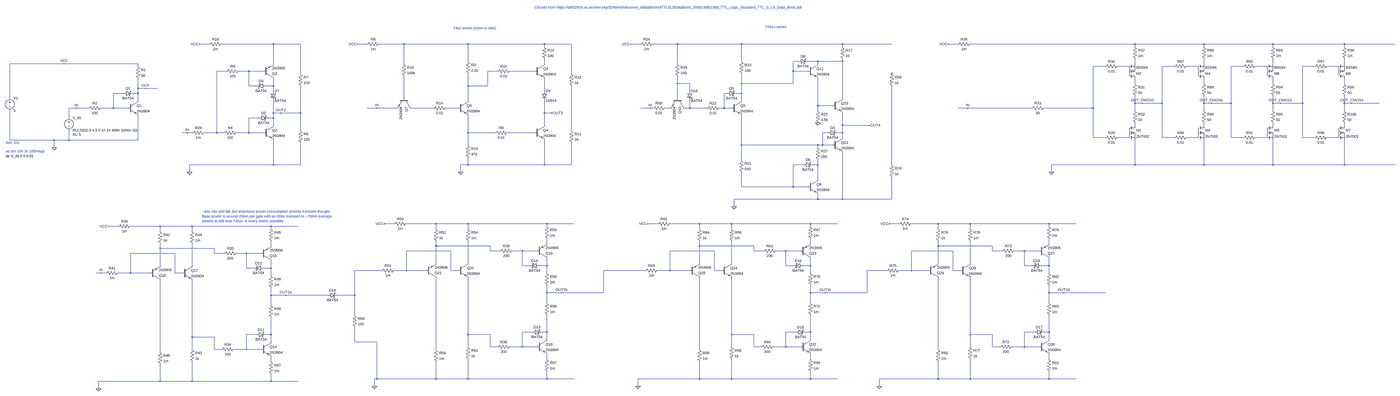
[diagram p0: schematic ttl_inverters.asc, whole sheet]
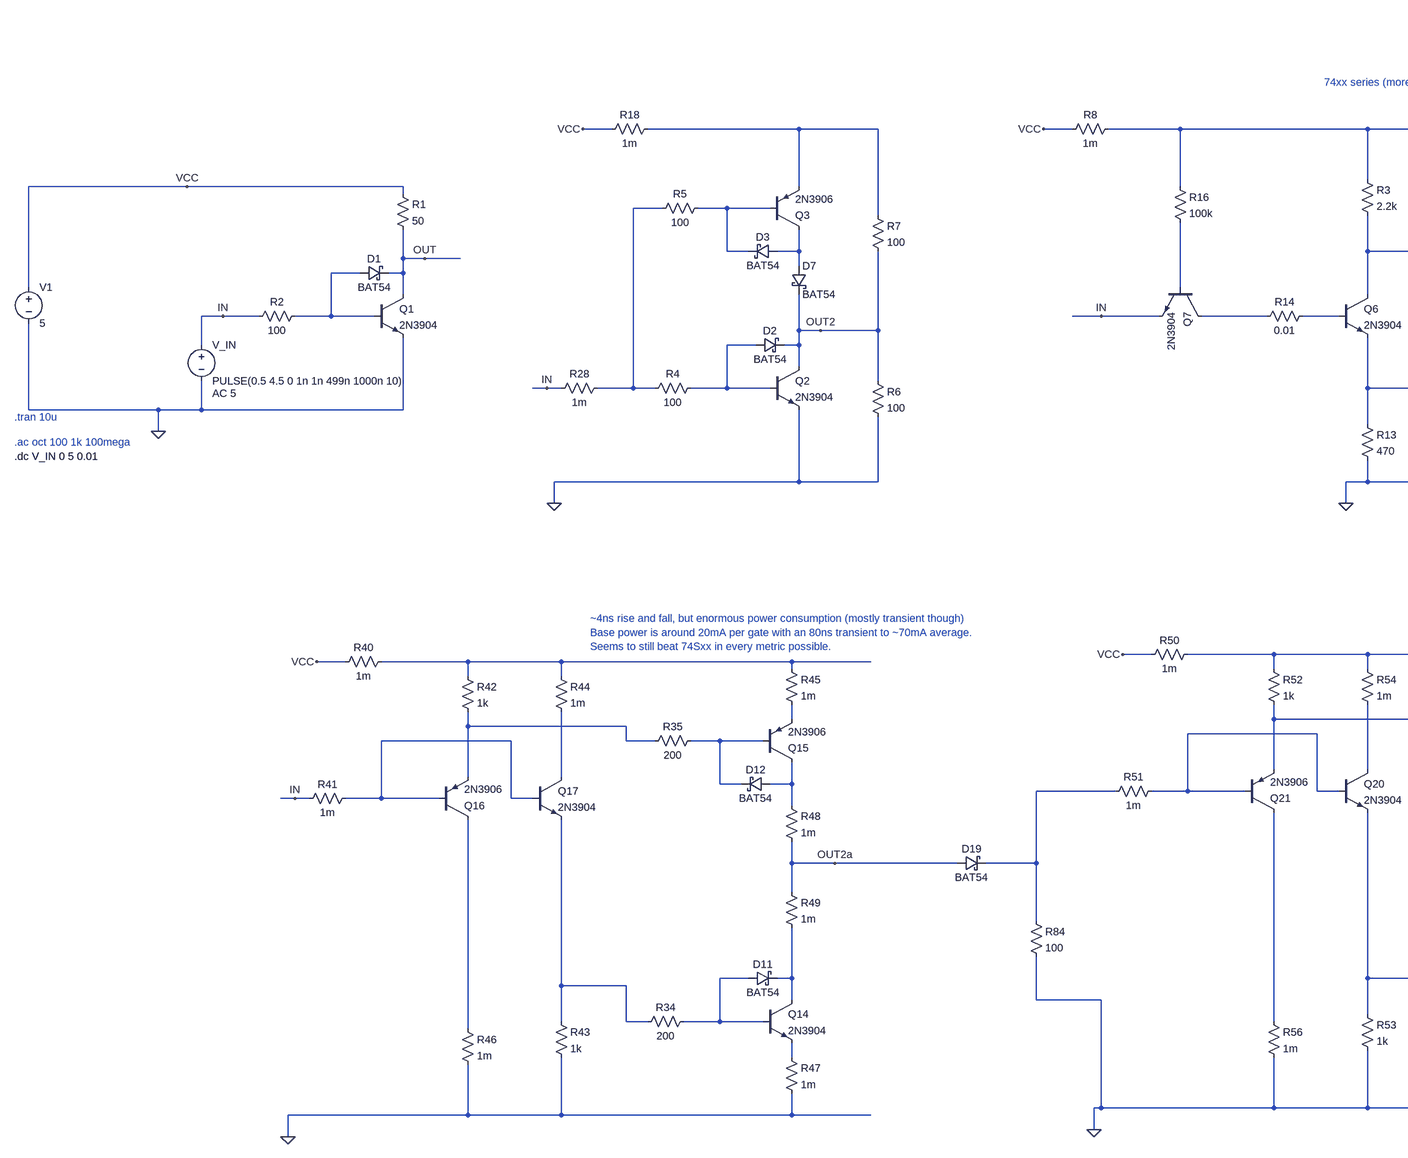
[diagram p1: schematic ttl_inverters.asc, part, row 1 of 1, column 1 of 3]
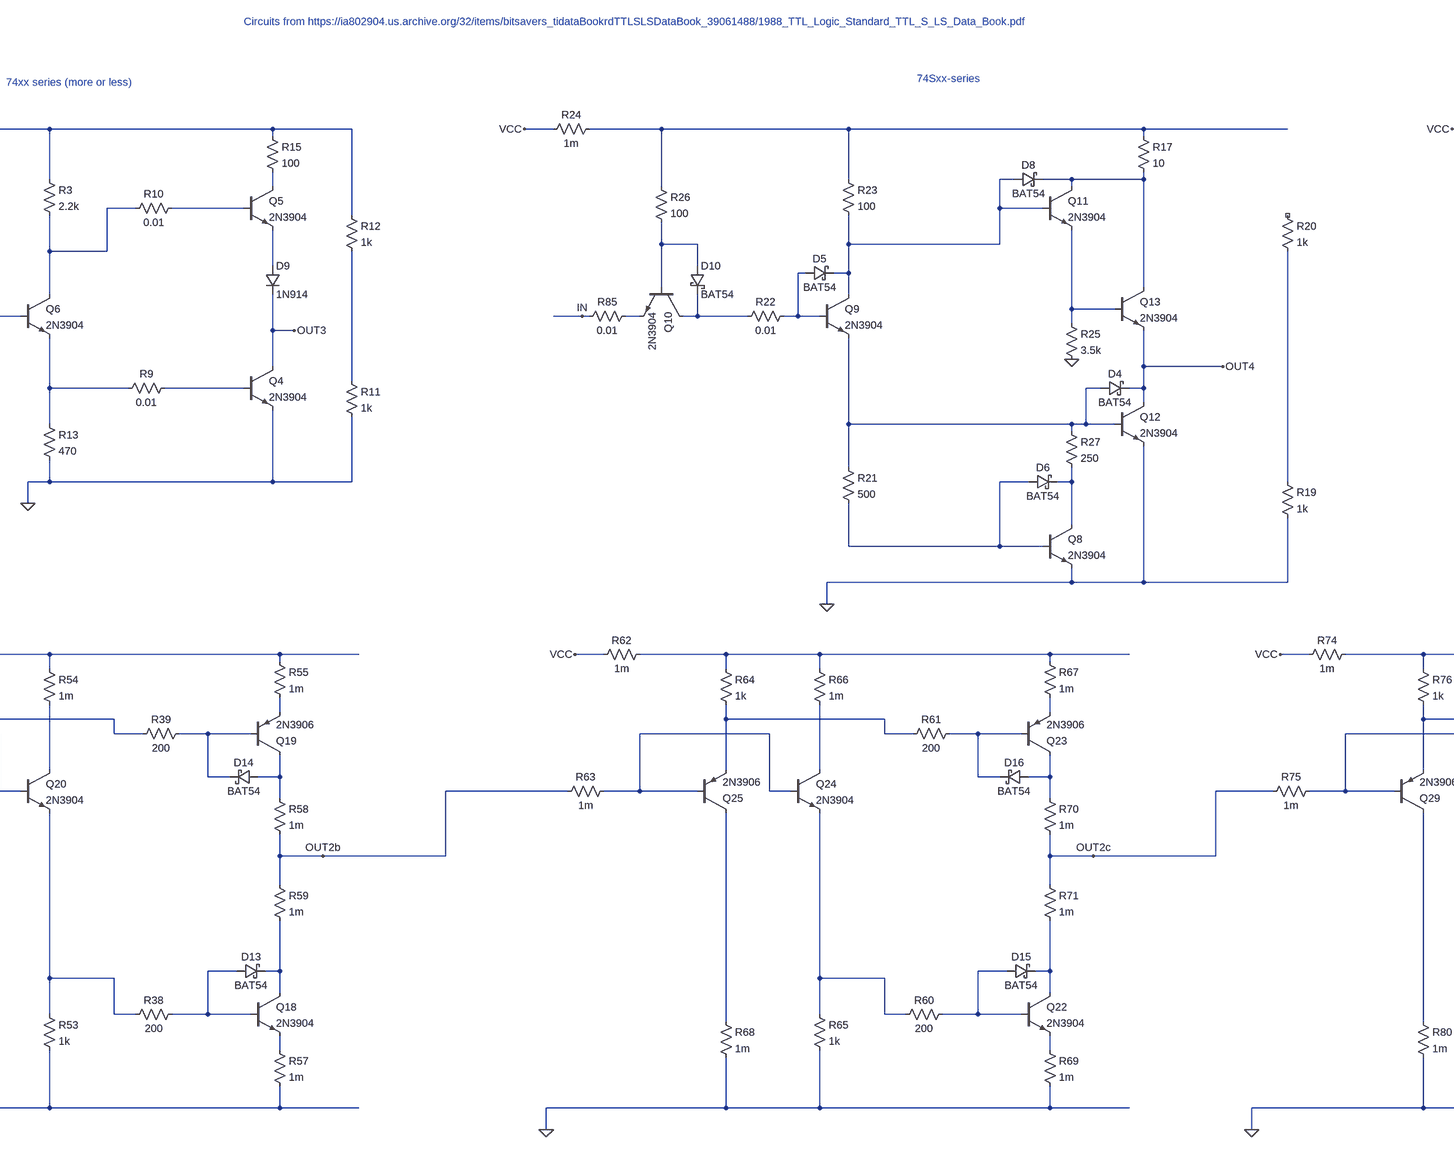
[diagram p2: schematic ttl_inverters.asc, part, row 1 of 1, column 2 of 3]
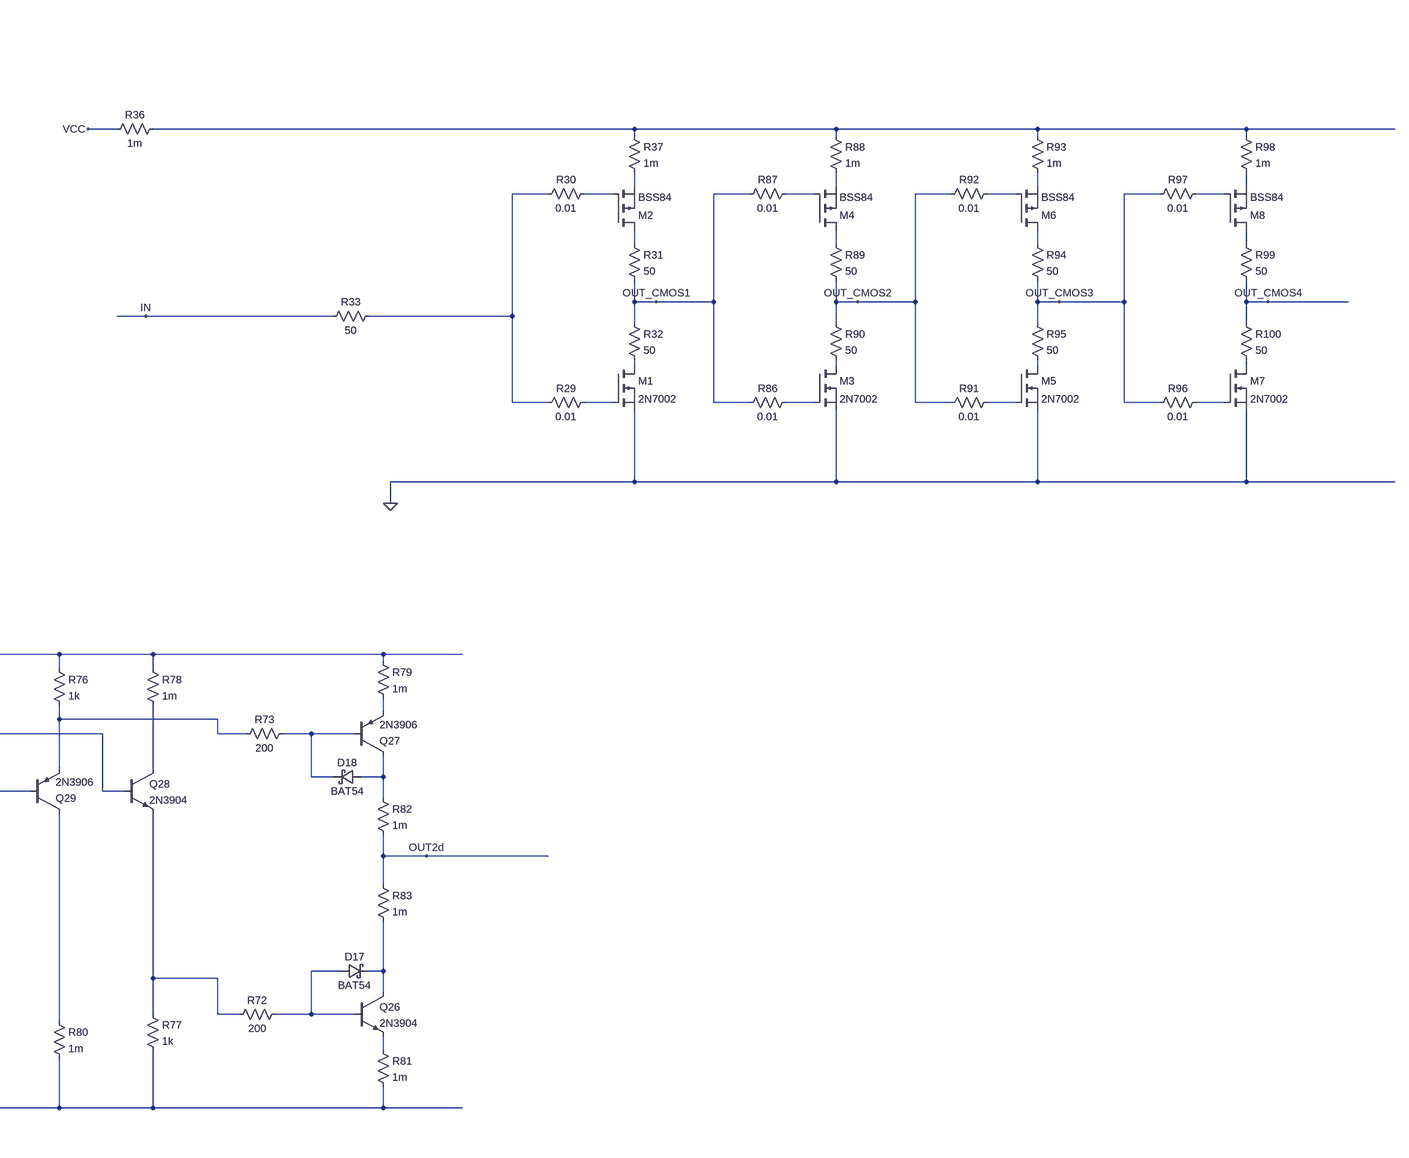
[diagram p3: schematic ttl_inverters.asc, part, row 1 of 1, column 3 of 3]
ttl_inverters.asc, the LTspice schematic file:
Version 4
SHEET 1 8772 1940
WIRE 768 -320 704 -320
WIRE 1184 -320 848 -320
WIRE 1360 -320 1184 -320
WIRE 1792 -320 1728 -320
WIRE 2032 -320 1872 -320
WIRE 2448 -320 2032 -320
WIRE 2944 -320 2448 -320
WIRE 3120 -320 2944 -320
WIRE 3568 -320 3504 -320
WIRE 3808 -320 3648 -320
WIRE 4224 -320 3808 -320
WIRE 4880 -320 4224 -320
WIRE 5200 -320 4880 -320
WIRE 5648 -320 5584 -320
WIRE 6800 -320 5728 -320
WIRE 7248 -320 6800 -320
WIRE 7696 -320 7248 -320
WIRE 8160 -320 7696 -320
WIRE 8768 -320 8160 -320
WIRE 2944 -304 2944 -320
WIRE 4880 -304 4880 -320
WIRE 6800 -304 6800 -320
WIRE 7248 -304 7248 -320
WIRE 7696 -304 7696 -320
WIRE 8160 -304 8160 -320
WIRE 2448 -208 2448 -320
WIRE 4224 -208 4224 -320
WIRE 4592 -208 4560 -208
WIRE 4720 -208 4656 -208
WIRE 4880 -208 4880 -224
WIRE 4880 -208 4720 -208
WIRE -176 -192 -528 -192
WIRE 304 -192 -176 -192
WIRE 1184 -192 1184 -320
WIRE 2032 -192 2032 -320
WIRE 2944 -192 2944 -224
WIRE 3808 -192 3808 -320
WIRE 4720 -192 4720 -208
WIRE 6800 -192 6800 -224
WIRE 7248 -192 7248 -224
WIRE 7696 -192 7696 -224
WIRE 8160 -192 8160 -224
WIRE 304 -176 304 -192
WIRE 6608 -176 6528 -176
WIRE 6752 -176 6688 -176
WIRE 7056 -176 6976 -176
WIRE 7200 -176 7136 -176
WIRE 7504 -176 7424 -176
WIRE 7648 -176 7584 -176
WIRE 7968 -176 7888 -176
WIRE 8112 -176 8048 -176
WIRE 880 -144 816 -144
WIRE 1024 -144 960 -144
WIRE 1120 -144 1024 -144
WIRE 2640 -144 2576 -144
WIRE 2880 -144 2720 -144
WIRE 4560 -144 4560 -208
WIRE 4656 -144 4560 -144
WIRE 1360 -128 1360 -320
WIRE 3120 -128 3120 -320
WIRE 3808 -64 3808 -112
WIRE 3888 -64 3808 -64
WIRE 4224 -64 4224 -128
WIRE 4560 -64 4560 -144
WIRE 4560 -64 4224 -64
WIRE 6800 -64 6800 -96
WIRE 7248 -64 7248 -96
WIRE 7696 -64 7696 -96
WIRE 8160 -64 8160 -96
WIRE 1024 -48 1024 -144
WIRE 1072 -48 1024 -48
WIRE 1184 -48 1184 -96
WIRE 1184 -48 1136 -48
WIRE 2448 -48 2448 -128
WIRE 2576 -48 2576 -144
WIRE 2576 -48 2448 -48
WIRE 304 -32 304 -96
WIRE 352 -32 304 -32
WIRE 432 -32 352 -32
WIRE 1184 -16 1184 -48
WIRE 2944 -16 2944 -96
WIRE 3888 -16 3888 -64
WIRE 208 0 144 0
WIRE 304 0 304 -32
WIRE 304 0 272 0
WIRE 4128 0 4112 0
WIRE 4224 0 4224 -64
WIRE 4224 0 4192 0
WIRE -528 32 -528 -192
WIRE 2032 32 2032 -112
WIRE 3808 32 3808 -64
WIRE 4880 32 4880 -208
WIRE 304 48 304 0
WIRE 2448 48 2448 -48
WIRE 4224 48 4224 0
WIRE 6800 64 6800 16
WIRE 6848 64 6800 64
WIRE 6976 64 6976 -176
WIRE 6976 64 6848 64
WIRE 7248 64 7248 16
WIRE 7296 64 7248 64
WIRE 7424 64 7424 -176
WIRE 7424 64 7296 64
WIRE 7696 64 7696 16
WIRE 7744 64 7696 64
WIRE 7888 64 7888 -176
WIRE 7888 64 7744 64
WIRE 8160 64 8160 16
WIRE 8208 64 8160 64
WIRE 8448 64 8208 64
WIRE 4720 80 4720 -96
WIRE 4816 80 4720 80
WIRE -96 96 -144 96
WIRE -16 96 -96 96
WIRE 144 96 144 0
WIRE 144 96 64 96
WIRE 240 96 144 96
WIRE 1856 96 1792 96
WIRE 1984 96 1856 96
WIRE 2224 96 2080 96
WIRE 2384 96 2304 96
WIRE 3632 96 3568 96
WIRE 3648 96 3632 96
WIRE 3760 96 3728 96
WIRE 3888 96 3888 48
WIRE 3888 96 3856 96
WIRE 4000 96 3888 96
WIRE 4112 96 4112 0
WIRE 4112 96 4080 96
WIRE 4160 96 4112 96
WIRE 5712 96 5648 96
WIRE 6128 96 5712 96
WIRE 6528 96 6528 -176
WIRE 6528 96 6208 96
WIRE 4720 112 4720 80
WIRE 6800 112 6800 64
WIRE 7248 112 7248 64
WIRE 7696 112 7696 64
WIRE 8160 112 8160 64
WIRE 1184 128 1184 48
WIRE 1232 128 1184 128
WIRE 1360 128 1360 -48
WIRE 1360 128 1232 128
WIRE 2944 128 2944 48
WIRE 2992 128 2944 128
WIRE -144 160 -144 96
WIRE 1088 160 1024 160
WIRE 1184 160 1184 128
WIRE 1184 160 1152 160
WIRE 1184 208 1184 160
WIRE 2944 208 2944 128
WIRE 4880 208 4880 128
WIRE 5056 208 4880 208
WIRE 6800 208 6800 192
WIRE 7248 208 7248 192
WIRE 7696 208 7696 192
WIRE 8160 208 8160 192
WIRE 1360 240 1360 128
WIRE 3120 240 3120 -48
WIRE 624 256 592 256
WIRE 656 256 624 256
WIRE 816 256 816 -144
WIRE 816 256 736 256
WIRE 864 256 816 256
WIRE 1024 256 1024 160
WIRE 1024 256 944 256
WIRE 1120 256 1024 256
WIRE 2448 256 2448 144
WIRE 2624 256 2448 256
WIRE 2880 256 2704 256
WIRE 4784 256 4752 256
WIRE 4880 256 4880 208
WIRE 4880 256 4848 256
WIRE 4880 288 4880 256
WIRE 6528 288 6528 96
WIRE 6608 288 6528 288
WIRE 6752 288 6688 288
WIRE 6976 288 6976 64
WIRE 7056 288 6976 288
WIRE 7200 288 7136 288
WIRE 7424 288 7424 64
WIRE 7504 288 7424 288
WIRE 7648 288 7584 288
WIRE 7888 288 7888 64
WIRE 7968 288 7888 288
WIRE 8112 288 8048 288
WIRE -528 304 -528 112
WIRE -240 304 -528 304
WIRE -144 304 -144 240
WIRE -144 304 -240 304
WIRE 304 304 304 144
WIRE 304 304 -144 304
WIRE 2448 336 2448 256
WIRE 4224 336 4224 144
WIRE 4720 336 4224 336
WIRE 4752 336 4752 256
WIRE 4752 336 4720 336
WIRE 4816 336 4752 336
WIRE -240 352 -240 304
WIRE 4720 352 4720 336
WIRE 4224 432 4224 336
WIRE 1184 464 1184 304
WIRE 1184 464 640 464
WIRE 1360 464 1360 320
WIRE 1360 464 1184 464
WIRE 2448 464 2448 416
WIRE 2448 464 2400 464
WIRE 2944 464 2944 304
WIRE 2944 464 2448 464
WIRE 3120 464 3120 320
WIRE 3120 464 2944 464
WIRE 4624 464 4560 464
WIRE 4720 464 4720 432
WIRE 4720 464 4688 464
WIRE 5200 464 5200 -48
WIRE 6800 464 6800 304
WIRE 6800 464 6256 464
WIRE 7248 464 7248 304
WIRE 7248 464 6800 464
WIRE 7696 464 7696 304
WIRE 7696 464 7248 464
WIRE 8160 464 8160 304
WIRE 8160 464 7696 464
WIRE 8768 464 8160 464
WIRE 640 512 640 464
WIRE 2400 512 2400 464
WIRE 6256 512 6256 464
WIRE 4720 560 4720 464
WIRE 4224 608 4224 512
WIRE 4560 608 4560 464
WIRE 4560 608 4224 608
WIRE 4656 608 4560 608
WIRE 4720 688 4720 656
WIRE 4720 688 4176 688
WIRE 4880 688 4880 384
WIRE 4880 688 4720 688
WIRE 5200 688 5200 544
WIRE 5200 688 4880 688
WIRE 4176 736 4176 688
WIRE 1968 848 1904 848
WIRE 2240 848 2048 848
WIRE 2448 848 2240 848
WIRE 2960 848 2448 848
WIRE 3136 848 2960 848
WIRE 3680 848 3616 848
WIRE 3952 848 3760 848
WIRE 4160 848 3952 848
WIRE 4672 848 4160 848
WIRE 4848 848 4672 848
WIRE 5248 848 5184 848
WIRE 5520 848 5328 848
WIRE 5728 848 5520 848
WIRE 6240 848 5728 848
WIRE 6416 848 6240 848
WIRE 176 864 112 864
WIRE 448 864 256 864
WIRE 656 864 448 864
WIRE 1168 864 656 864
WIRE 1344 864 1168 864
WIRE 2960 864 2960 848
WIRE 4672 864 4672 848
WIRE 6240 864 6240 848
WIRE 1168 880 1168 864
WIRE 2240 880 2240 848
WIRE 2448 880 2448 848
WIRE 3952 880 3952 848
WIRE 4160 880 4160 848
WIRE 5520 880 5520 848
WIRE 5728 880 5728 848
WIRE 448 896 448 864
WIRE 656 896 656 864
WIRE 2960 976 2960 944
WIRE 4672 976 4672 944
WIRE 6240 976 6240 944
WIRE 1168 992 1168 960
WIRE 2240 992 2240 960
WIRE 2592 992 2240 992
WIRE 3952 992 3952 960
WIRE 4304 992 3952 992
WIRE 5520 992 5520 960
WIRE 5872 992 5520 992
WIRE 448 1008 448 976
WIRE 800 1008 448 1008
WIRE 2336 1024 2048 1024
WIRE 2592 1024 2592 992
WIRE 2656 1024 2592 1024
WIRE 2800 1024 2736 1024
WIRE 2896 1024 2800 1024
WIRE 4048 1024 3760 1024
WIRE 4304 1024 4304 992
WIRE 4368 1024 4304 1024
WIRE 4512 1024 4448 1024
WIRE 4608 1024 4512 1024
WIRE 5616 1024 5328 1024
WIRE 5872 1024 5872 992
WIRE 5936 1024 5872 1024
WIRE 6080 1024 6016 1024
WIRE 6176 1024 6080 1024
WIRE 544 1040 256 1040
WIRE 800 1040 800 1008
WIRE 864 1040 800 1040
WIRE 1008 1040 944 1040
WIRE 1104 1040 1008 1040
WIRE 2240 1104 2240 992
WIRE 2448 1104 2448 960
WIRE 3952 1104 3952 992
WIRE 4160 1104 4160 960
WIRE 5520 1104 5520 992
WIRE 5728 1104 5728 960
WIRE 448 1120 448 1008
WIRE 656 1120 656 976
WIRE 2800 1120 2800 1024
WIRE 2848 1120 2800 1120
WIRE 2960 1120 2960 1072
WIRE 2960 1120 2912 1120
WIRE 4512 1120 4512 1024
WIRE 4560 1120 4512 1120
WIRE 4672 1120 4672 1072
WIRE 4672 1120 4624 1120
WIRE 6080 1120 6080 1024
WIRE 6128 1120 6080 1120
WIRE 6240 1120 6240 1072
WIRE 6240 1120 6192 1120
WIRE 1008 1136 1008 1040
WIRE 1056 1136 1008 1136
WIRE 1168 1136 1168 1088
WIRE 1168 1136 1120 1136
WIRE 1888 1152 1712 1152
WIRE 2048 1152 2048 1024
WIRE 2048 1152 1968 1152
WIRE 2176 1152 2048 1152
WIRE 2336 1152 2336 1024
WIRE 2384 1152 2336 1152
WIRE 3600 1152 3328 1152
WIRE 3760 1152 3760 1024
WIRE 3760 1152 3680 1152
WIRE 3888 1152 3760 1152
WIRE 4048 1152 4048 1024
WIRE 4096 1152 4048 1152
WIRE 5168 1152 5040 1152
WIRE 5328 1152 5328 1024
WIRE 5328 1152 5248 1152
WIRE 5456 1152 5328 1152
WIRE 5616 1152 5616 1024
WIRE 5664 1152 5616 1152
WIRE 64 1168 32 1168
WIRE 96 1168 64 1168
WIRE 256 1168 256 1040
WIRE 256 1168 176 1168
WIRE 384 1168 256 1168
WIRE 544 1168 544 1040
WIRE 592 1168 544 1168
WIRE 2960 1168 2960 1120
WIRE 4672 1168 4672 1120
WIRE 6240 1168 6240 1120
WIRE 1168 1184 1168 1136
WIRE 2960 1296 2960 1248
WIRE 3056 1296 2960 1296
WIRE 3328 1296 3328 1152
WIRE 3328 1296 3056 1296
WIRE 4672 1296 4672 1248
WIRE 4768 1296 4672 1296
WIRE 5040 1296 5040 1152
WIRE 5040 1296 4768 1296
WIRE 6240 1296 6240 1248
WIRE 6336 1296 6240 1296
WIRE 6608 1296 6336 1296
WIRE 1168 1312 1168 1264
WIRE 1264 1312 1168 1312
WIRE 1536 1312 1264 1312
WIRE 1712 1312 1712 1152
WIRE 1712 1312 1600 1312
WIRE 2960 1360 2960 1296
WIRE 4672 1360 4672 1296
WIRE 6240 1360 6240 1296
WIRE 1168 1376 1168 1312
WIRE 1712 1440 1712 1312
WIRE 2864 1552 2800 1552
WIRE 2960 1552 2960 1440
WIRE 2960 1552 2928 1552
WIRE 4576 1552 4512 1552
WIRE 4672 1552 4672 1440
WIRE 4672 1552 4640 1552
WIRE 6144 1552 6080 1552
WIRE 6240 1552 6240 1440
WIRE 6240 1552 6208 1552
WIRE 1072 1568 1008 1568
WIRE 1168 1568 1168 1456
WIRE 1168 1568 1136 1568
WIRE 2448 1568 2448 1200
WIRE 2592 1568 2448 1568
WIRE 4160 1568 4160 1200
WIRE 4304 1568 4160 1568
WIRE 5728 1568 5728 1200
WIRE 5872 1568 5728 1568
WIRE 656 1584 656 1216
WIRE 800 1584 656 1584
WIRE 2960 1600 2960 1552
WIRE 4672 1600 4672 1552
WIRE 6240 1600 6240 1552
WIRE 1168 1616 1168 1568
WIRE 1712 1616 1712 1520
WIRE 1856 1616 1712 1616
WIRE 2448 1648 2448 1568
WIRE 2592 1648 2592 1568
WIRE 2640 1648 2592 1648
WIRE 2800 1648 2800 1552
WIRE 2800 1648 2720 1648
WIRE 2896 1648 2800 1648
WIRE 4160 1648 4160 1568
WIRE 4304 1648 4304 1568
WIRE 4352 1648 4304 1648
WIRE 4512 1648 4512 1552
WIRE 4512 1648 4432 1648
WIRE 4608 1648 4512 1648
WIRE 5728 1648 5728 1568
WIRE 5872 1648 5872 1568
WIRE 5920 1648 5872 1648
WIRE 6080 1648 6080 1552
WIRE 6080 1648 6000 1648
WIRE 6176 1648 6080 1648
WIRE 656 1664 656 1584
WIRE 800 1664 800 1584
WIRE 848 1664 800 1664
WIRE 1008 1664 1008 1568
WIRE 1008 1664 928 1664
WIRE 1104 1664 1008 1664
WIRE 2240 1664 2240 1200
WIRE 3952 1664 3952 1200
WIRE 5520 1664 5520 1200
WIRE 448 1680 448 1216
WIRE 2960 1728 2960 1696
WIRE 4672 1728 4672 1696
WIRE 6240 1728 6240 1696
WIRE 1168 1744 1168 1712
WIRE 1856 1856 1856 1616
WIRE 1856 1856 1840 1856
WIRE 2240 1856 2240 1744
WIRE 2240 1856 1856 1856
WIRE 2448 1856 2448 1728
WIRE 2448 1856 2240 1856
WIRE 2960 1856 2960 1808
WIRE 2960 1856 2448 1856
WIRE 3136 1856 2960 1856
WIRE 3952 1856 3952 1744
WIRE 3952 1856 3552 1856
WIRE 4160 1856 4160 1728
WIRE 4160 1856 3952 1856
WIRE 4672 1856 4672 1808
WIRE 4672 1856 4160 1856
WIRE 4848 1856 4672 1856
WIRE 5520 1856 5520 1744
WIRE 5520 1856 5120 1856
WIRE 5728 1856 5728 1728
WIRE 5728 1856 5520 1856
WIRE 6240 1856 6240 1808
WIRE 6240 1856 5728 1856
WIRE 6416 1856 6240 1856
WIRE 448 1872 448 1760
WIRE 448 1872 48 1872
WIRE 656 1872 656 1744
WIRE 656 1872 448 1872
WIRE 1168 1872 1168 1824
WIRE 1168 1872 656 1872
WIRE 1344 1872 1168 1872
WIRE 1840 1904 1840 1856
WIRE 3552 1904 3552 1856
WIRE 5120 1904 5120 1856
WIRE 48 1920 48 1872
FLAG -240 352 0
FLAG 352 -32 OUT
FLAG -96 96 IN
FLAG -176 -192 VCC
FLAG 640 512 0
FLAG 1232 128 OUT2
FLAG 624 256 IN
FLAG 704 -320 VCC
FLAG 2400 512 0
FLAG 2992 128 OUT3
FLAG 1856 96 IN
FLAG 1728 -320 VCC
FLAG 4176 736 0
FLAG 3632 96 IN
FLAG 3504 -320 VCC
FLAG 4720 192 0
FLAG 5056 208 OUT4
FLAG 6256 512 0
FLAG 6848 64 OUT_CMOS1
FLAG 5712 96 IN
FLAG 5584 -320 VCC
FLAG 48 1920 0
FLAG 1264 1312 OUT2a
FLAG 64 1168 IN
FLAG 112 864 VCC
FLAG 1840 1904 0
FLAG 3056 1296 OUT2b
FLAG 1904 848 VCC
FLAG 3552 1904 0
FLAG 4768 1296 OUT2c
FLAG 3616 848 VCC
FLAG 5120 1904 0
FLAG 6336 1296 OUT2d
FLAG 5184 848 VCC
FLAG 7296 64 OUT_CMOS2
FLAG 7744 64 OUT_CMOS3
FLAG 8208 64 OUT_CMOS4
SYMBOL res 288 -192 R0
SYMATTR InstName R1
SYMATTR Value 50
SYMBOL voltage -528 16 R0
WINDOW 123 0 0 Left 0
WINDOW 39 0 0 Left 0
SYMATTR InstName V1
SYMATTR Value 5
SYMBOL voltage -144 144 R0
WINDOW 123 24 124 Left 2
WINDOW 39 0 0 Left 0
SYMATTR Value2 AC 5
SYMATTR InstName V_IN
SYMATTR Value PULSE(0.5 4.5 0 1n 1n 499n 1000n 10)
SYMBOL res 80 80 R90
WINDOW 0 0 56 VBottom 2
WINDOW 3 32 56 VTop 2
SYMATTR InstName R2
SYMATTR Value 100
SYMBOL npn 240 48 R0
SYMATTR InstName Q1
SYMATTR Value 2N3904
SYMBOL schottky 208 16 R270
WINDOW 0 32 32 VTop 2
WINDOW 3 0 32 VBottom 2
SYMATTR InstName D1
SYMATTR Value BAT54
SYMATTR Description Diode
SYMATTR Type diode
SYMBOL res 960 240 R90
WINDOW 0 0 56 VBottom 2
WINDOW 3 32 56 VTop 2
SYMATTR InstName R4
SYMATTR Value 100
SYMBOL npn 1120 208 R0
SYMATTR InstName Q2
SYMATTR Value 2N3904
SYMBOL schottky 1088 176 R270
WINDOW 0 32 32 VTop 2
WINDOW 3 0 32 VBottom 2
SYMATTR InstName D2
SYMATTR Value BAT54
SYMATTR Description Diode
SYMATTR Type diode
SYMBOL pnp 1120 -96 M180
SYMATTR InstName Q3
SYMATTR Value 2N3906
SYMBOL schottky 1136 -64 R90
WINDOW 0 0 32 VBottom 2
WINDOW 3 32 32 VTop 2
SYMATTR InstName D3
SYMATTR Value BAT54
SYMATTR Description Diode
SYMATTR Type diode
SYMBOL res 976 -160 R90
WINDOW 0 0 56 VBottom 2
WINDOW 3 32 56 VTop 2
SYMATTR InstName R5
SYMATTR Value 100
SYMBOL res 1344 224 R0
SYMATTR InstName R6
SYMATTR Value 100
SYMBOL res 1344 -144 R0
SYMATTR InstName R7
SYMATTR Value 100
SYMBOL res 2720 240 R90
WINDOW 0 0 56 VBottom 2
WINDOW 3 32 56 VTop 2
SYMATTR InstName R9
SYMATTR Value 0.01
SYMBOL npn 2880 208 R0
SYMATTR InstName Q4
SYMATTR Value 2N3904
SYMBOL res 2736 -160 R90
WINDOW 0 0 56 VBottom 2
WINDOW 3 32 56 VTop 2
SYMATTR InstName R10
SYMATTR Value 0.01
SYMBOL res 3104 224 R0
SYMATTR InstName R11
SYMATTR Value 1k
SYMBOL res 3104 -144 R0
SYMATTR InstName R12
SYMATTR Value 1k
SYMBOL npn 2384 48 R0
SYMATTR InstName Q6
SYMATTR Value 2N3904
SYMBOL res 2432 320 R0
SYMATTR InstName R13
SYMATTR Value 470
SYMBOL res 2320 80 R90
WINDOW 0 0 56 VBottom 2
WINDOW 3 32 56 VTop 2
SYMATTR InstName R14
SYMATTR Value 0.01
SYMBOL schottky 1168 -16 R0
SYMATTR InstName D7
SYMATTR Value BAT54
SYMATTR Description Diode
SYMATTR Type diode
SYMBOL res 2432 -224 R0
SYMATTR InstName R3
SYMATTR Value 2.2k
SYMBOL res 1776 -304 R270
WINDOW 0 32 56 VTop 2
WINDOW 3 0 56 VBottom 2
SYMATTR InstName R8
SYMATTR Value 1m
SYMBOL res 2928 -320 R0
SYMATTR InstName R15
SYMATTR Value 100
SYMBOL res 2016 -208 R0
SYMATTR InstName R16
SYMATTR Value 100k
SYMBOL npn 2080 32 R90
SYMATTR InstName Q7
SYMATTR Value 2N3904
SYMBOL npn 2880 -192 R0
SYMATTR InstName Q5
SYMATTR Value 2N3904
SYMBOL npn 4656 560 R0
SYMATTR InstName Q8
SYMATTR Value 2N3904
SYMBOL schottky 4624 480 R270
WINDOW 0 32 32 VTop 2
WINDOW 3 0 32 VBottom 2
SYMATTR InstName D6
SYMATTR Value BAT54
SYMATTR Description Diode
SYMATTR Type diode
SYMBOL schottky 4592 -192 R270
WINDOW 0 32 32 VTop 2
WINDOW 3 0 32 VBottom 2
SYMATTR InstName D8
SYMATTR Value BAT54
SYMATTR Description Diode
SYMATTR Type diode
SYMBOL res 5184 448 R0
SYMATTR InstName R19
SYMATTR Value 1k
SYMBOL res 5184 -144 R0
SYMATTR InstName R20
SYMATTR Value 1k
SYMBOL npn 4160 48 R0
SYMATTR InstName Q9
SYMATTR Value 2N3904
SYMBOL res 4208 416 R0
SYMATTR InstName R21
SYMATTR Value 500
SYMBOL res 4096 80 R90
WINDOW 0 0 56 VBottom 2
WINDOW 3 32 56 VTop 2
SYMATTR InstName R22
SYMATTR Value 0.01
SYMBOL res 4208 -224 R0
SYMATTR InstName R23
SYMATTR Value 100
SYMBOL res 3552 -304 R270
WINDOW 0 32 56 VTop 2
WINDOW 3 0 56 VBottom 2
SYMATTR InstName R24
SYMATTR Value 1m
SYMBOL res 3792 -208 R0
SYMATTR InstName R26
SYMATTR Value 100
SYMBOL npn 3856 32 R90
SYMATTR InstName Q10
SYMATTR Value 2N3904
SYMBOL npn 4656 -192 R0
SYMATTR InstName Q11
SYMATTR Value 2N3904
SYMBOL diode 2928 -16 R0
SYMATTR InstName D9
SYMATTR Value 1N914
SYMBOL npn 4816 288 R0
SYMATTR InstName Q12
SYMATTR Value 2N3904
SYMBOL res 4704 336 R0
SYMATTR InstName R27
SYMATTR Value 250
SYMBOL schottky 4784 272 R270
WINDOW 0 32 32 VTop 2
WINDOW 3 0 32 VBottom 2
SYMATTR InstName D4
SYMATTR Value BAT54
SYMATTR Description Diode
SYMATTR Type diode
SYMBOL npn 4816 32 R0
SYMATTR InstName Q13
SYMATTR Value 2N3904
SYMBOL res 4864 -320 R0
SYMATTR InstName R17
SYMATTR Value 10
SYMBOL res 4704 96 R0
SYMATTR InstName R25
SYMATTR Value 3.5k
SYMBOL schottky 4128 16 R270
WINDOW 0 32 32 VTop 2
WINDOW 3 0 32 VBottom 2
SYMATTR InstName D5
SYMATTR Value BAT54
SYMATTR Description Diode
SYMATTR Type diode
SYMBOL schottky 3872 -16 R0
SYMATTR InstName D10
SYMATTR Value BAT54
SYMATTR Description Diode
SYMATTR Type diode
SYMBOL res 752 -304 R270
WINDOW 0 32 56 VTop 2
WINDOW 3 0 56 VBottom 2
SYMATTR InstName R18
SYMATTR Value 1m
SYMBOL res 640 272 R270
WINDOW 0 32 56 VTop 2
WINDOW 3 0 56 VBottom 2
SYMATTR InstName R28
SYMATTR Value 1m
SYMBOL res 6704 272 R90
WINDOW 0 0 56 VBottom 2
WINDOW 3 32 56 VTop 2
SYMATTR InstName R29
SYMATTR Value 0.01
SYMBOL res 6704 -192 R90
WINDOW 0 0 56 VBottom 2
WINDOW 3 32 56 VTop 2
SYMATTR InstName R30
SYMATTR Value 0.01
SYMBOL res 5632 -304 R270
WINDOW 0 32 56 VTop 2
WINDOW 3 0 56 VBottom 2
SYMATTR InstName R36
SYMATTR Value 1m
SYMBOL res 6784 -320 R0
SYMATTR InstName R37
SYMATTR Value 1m
SYMBOL nmos 6752 208 R0
SYMATTR InstName M1
SYMATTR Value 2N7002
SYMBOL pmos 6752 -96 M180
SYMATTR InstName M2
SYMATTR Value BSS84
SYMBOL res 6224 80 R90
WINDOW 0 0 56 VBottom 2
WINDOW 3 32 56 VTop 2
SYMATTR InstName R33
SYMATTR Value 50
SYMBOL res 832 1680 R270
WINDOW 0 32 56 VTop 2
WINDOW 3 0 56 VBottom 2
SYMATTR InstName R34
SYMATTR Value 200
SYMBOL npn 1104 1616 R0
SYMATTR InstName Q14
SYMATTR Value 2N3904
SYMBOL schottky 1072 1584 R270
WINDOW 0 32 32 VTop 2
WINDOW 3 0 32 VBottom 2
SYMATTR InstName D11
SYMATTR Value BAT54
SYMATTR Description Diode
SYMATTR Type diode
SYMBOL pnp 1104 1088 M180
SYMATTR InstName Q15
SYMATTR Value 2N3906
SYMBOL schottky 1120 1120 R90
WINDOW 0 0 32 VBottom 2
WINDOW 3 32 32 VTop 2
SYMATTR InstName D12
SYMATTR Value BAT54
SYMATTR Description Diode
SYMATTR Type diode
SYMBOL res 960 1024 R90
WINDOW 0 0 56 VBottom 2
WINDOW 3 32 56 VTop 2
SYMATTR InstName R35
SYMATTR Value 200
SYMBOL res 160 880 R270
WINDOW 0 32 56 VTop 2
WINDOW 3 0 56 VBottom 2
SYMATTR InstName R40
SYMATTR Value 1m
SYMBOL res 80 1184 R270
WINDOW 0 32 56 VTop 2
WINDOW 3 0 56 VBottom 2
SYMATTR InstName R41
SYMATTR Value 1m
SYMBOL res 432 880 R0
SYMATTR InstName R42
SYMATTR Value 1k
SYMBOL npn 592 1120 R0
SYMATTR InstName Q17
SYMATTR Value 2N3904
SYMBOL res 640 1648 R0
SYMATTR InstName R43
SYMATTR Value 1k
SYMBOL pnp 384 1216 M180
SYMATTR InstName Q16
SYMATTR Value 2N3906
SYMBOL res 640 880 R0
SYMATTR InstName R44
SYMATTR Value 1m
SYMBOL res 1152 864 R0
SYMATTR InstName R45
SYMATTR Value 1m
SYMBOL res 432 1664 R0
SYMATTR InstName R46
SYMATTR Value 1m
SYMBOL res 1152 1728 R0
SYMATTR InstName R47
SYMATTR Value 1m
SYMBOL res 1152 1168 R0
SYMATTR InstName R48
SYMATTR Value 1m
SYMBOL res 1152 1360 R0
SYMATTR InstName R49
SYMATTR Value 1m
SYMBOL res 2624 1664 R270
WINDOW 0 32 56 VTop 2
WINDOW 3 0 56 VBottom 2
SYMATTR InstName R38
SYMATTR Value 200
SYMBOL npn 2896 1600 R0
SYMATTR InstName Q18
SYMATTR Value 2N3904
SYMBOL schottky 2864 1568 R270
WINDOW 0 32 32 VTop 2
WINDOW 3 0 32 VBottom 2
SYMATTR InstName D13
SYMATTR Value BAT54
SYMATTR Description Diode
SYMATTR Type diode
SYMBOL pnp 2896 1072 M180
SYMATTR InstName Q19
SYMATTR Value 2N3906
SYMBOL schottky 2912 1104 R90
WINDOW 0 0 32 VBottom 2
WINDOW 3 32 32 VTop 2
SYMATTR InstName D14
SYMATTR Value BAT54
SYMATTR Description Diode
SYMATTR Type diode
SYMBOL res 2752 1008 R90
WINDOW 0 0 56 VBottom 2
WINDOW 3 32 56 VTop 2
SYMATTR InstName R39
SYMATTR Value 200
SYMBOL res 1952 864 R270
WINDOW 0 32 56 VTop 2
WINDOW 3 0 56 VBottom 2
SYMATTR InstName R50
SYMATTR Value 1m
SYMBOL res 1872 1168 R270
WINDOW 0 32 56 VTop 2
WINDOW 3 0 56 VBottom 2
SYMATTR InstName R51
SYMATTR Value 1m
SYMBOL res 2224 864 R0
SYMATTR InstName R52
SYMATTR Value 1k
SYMBOL npn 2384 1104 R0
SYMATTR InstName Q20
SYMATTR Value 2N3904
SYMBOL res 2432 1632 R0
SYMATTR InstName R53
SYMATTR Value 1k
SYMBOL pnp 2176 1200 M180
SYMATTR InstName Q21
SYMATTR Value 2N3906
SYMBOL res 2432 864 R0
SYMATTR InstName R54
SYMATTR Value 1m
SYMBOL res 2944 848 R0
SYMATTR InstName R55
SYMATTR Value 1m
SYMBOL res 2224 1648 R0
SYMATTR InstName R56
SYMATTR Value 1m
SYMBOL res 2944 1712 R0
SYMATTR InstName R57
SYMATTR Value 1m
SYMBOL res 2944 1152 R0
SYMATTR InstName R58
SYMATTR Value 1m
SYMBOL res 2944 1344 R0
SYMATTR InstName R59
SYMATTR Value 1m
SYMBOL res 4336 1664 R270
WINDOW 0 32 56 VTop 2
WINDOW 3 0 56 VBottom 2
SYMATTR InstName R60
SYMATTR Value 200
SYMBOL npn 4608 1600 R0
SYMATTR InstName Q22
SYMATTR Value 2N3904
SYMBOL schottky 4576 1568 R270
WINDOW 0 32 32 VTop 2
WINDOW 3 0 32 VBottom 2
SYMATTR InstName D15
SYMATTR Value BAT54
SYMATTR Description Diode
SYMATTR Type diode
SYMBOL pnp 4608 1072 M180
SYMATTR InstName Q23
SYMATTR Value 2N3906
SYMBOL schottky 4624 1104 R90
WINDOW 0 0 32 VBottom 2
WINDOW 3 32 32 VTop 2
SYMATTR InstName D16
SYMATTR Value BAT54
SYMATTR Description Diode
SYMATTR Type diode
SYMBOL res 4464 1008 R90
WINDOW 0 0 56 VBottom 2
WINDOW 3 32 56 VTop 2
SYMATTR InstName R61
SYMATTR Value 200
SYMBOL res 3664 864 R270
WINDOW 0 32 56 VTop 2
WINDOW 3 0 56 VBottom 2
SYMATTR InstName R62
SYMATTR Value 1m
SYMBOL res 3584 1168 R270
WINDOW 0 32 56 VTop 2
WINDOW 3 0 56 VBottom 2
SYMATTR InstName R63
SYMATTR Value 1m
SYMBOL res 3936 864 R0
SYMATTR InstName R64
SYMATTR Value 1k
SYMBOL npn 4096 1104 R0
SYMATTR InstName Q24
SYMATTR Value 2N3904
SYMBOL res 4144 1632 R0
SYMATTR InstName R65
SYMATTR Value 1k
SYMBOL pnp 3888 1200 M180
SYMATTR InstName Q25
SYMATTR Value 2N3906
SYMBOL res 4144 864 R0
SYMATTR InstName R66
SYMATTR Value 1m
SYMBOL res 4656 848 R0
SYMATTR InstName R67
SYMATTR Value 1m
SYMBOL res 3936 1648 R0
SYMATTR InstName R68
SYMATTR Value 1m
SYMBOL res 4656 1712 R0
SYMATTR InstName R69
SYMATTR Value 1m
SYMBOL res 4656 1152 R0
SYMATTR InstName R70
SYMATTR Value 1m
SYMBOL res 4656 1344 R0
SYMATTR InstName R71
SYMATTR Value 1m
SYMBOL res 5904 1664 R270
WINDOW 0 32 56 VTop 2
WINDOW 3 0 56 VBottom 2
SYMATTR InstName R72
SYMATTR Value 200
SYMBOL npn 6176 1600 R0
SYMATTR InstName Q26
SYMATTR Value 2N3904
SYMBOL schottky 6144 1568 R270
WINDOW 0 32 32 VTop 2
WINDOW 3 0 32 VBottom 2
SYMATTR InstName D17
SYMATTR Value BAT54
SYMATTR Description Diode
SYMATTR Type diode
SYMBOL pnp 6176 1072 M180
SYMATTR InstName Q27
SYMATTR Value 2N3906
SYMBOL schottky 6192 1104 R90
WINDOW 0 0 32 VBottom 2
WINDOW 3 32 32 VTop 2
SYMATTR InstName D18
SYMATTR Value BAT54
SYMATTR Description Diode
SYMATTR Type diode
SYMBOL res 6032 1008 R90
WINDOW 0 0 56 VBottom 2
WINDOW 3 32 56 VTop 2
SYMATTR InstName R73
SYMATTR Value 200
SYMBOL res 5232 864 R270
WINDOW 0 32 56 VTop 2
WINDOW 3 0 56 VBottom 2
SYMATTR InstName R74
SYMATTR Value 1m
SYMBOL res 5152 1168 R270
WINDOW 0 32 56 VTop 2
WINDOW 3 0 56 VBottom 2
SYMATTR InstName R75
SYMATTR Value 1m
SYMBOL res 5504 864 R0
SYMATTR InstName R76
SYMATTR Value 1k
SYMBOL npn 5664 1104 R0
SYMATTR InstName Q28
SYMATTR Value 2N3904
SYMBOL res 5712 1632 R0
SYMATTR InstName R77
SYMATTR Value 1k
SYMBOL pnp 5456 1200 M180
SYMATTR InstName Q29
SYMATTR Value 2N3906
SYMBOL res 5712 864 R0
SYMATTR InstName R78
SYMATTR Value 1m
SYMBOL res 6224 848 R0
SYMATTR InstName R79
SYMATTR Value 1m
SYMBOL res 5504 1648 R0
SYMATTR InstName R80
SYMATTR Value 1m
SYMBOL res 6224 1712 R0
SYMATTR InstName R81
SYMATTR Value 1m
SYMBOL res 6224 1152 R0
SYMATTR InstName R82
SYMATTR Value 1m
SYMBOL res 6224 1344 R0
SYMATTR InstName R83
SYMATTR Value 1m
SYMBOL schottky 1536 1328 R270
WINDOW 0 32 32 VTop 2
WINDOW 3 0 32 VBottom 2
SYMATTR InstName D19
SYMATTR Value BAT54
SYMATTR Description Diode
SYMATTR Type diode
SYMBOL res 1696 1424 R0
SYMATTR InstName R84
SYMATTR Value 100
SYMBOL res 3632 112 R270
WINDOW 0 32 56 VTop 2
WINDOW 3 0 56 VBottom 2
SYMATTR InstName R85
SYMATTR Value 0.01
SYMBOL res 6784 -80 R0
SYMATTR InstName R31
SYMATTR Value 50
SYMBOL res 6784 96 R0
SYMATTR InstName R32
SYMATTR Value 50
SYMBOL res 7152 272 R90
WINDOW 0 0 56 VBottom 2
WINDOW 3 32 56 VTop 2
SYMATTR InstName R86
SYMATTR Value 0.01
SYMBOL res 7152 -192 R90
WINDOW 0 0 56 VBottom 2
WINDOW 3 32 56 VTop 2
SYMATTR InstName R87
SYMATTR Value 0.01
SYMBOL res 7232 -320 R0
SYMATTR InstName R88
SYMATTR Value 1m
SYMBOL nmos 7200 208 R0
SYMATTR InstName M3
SYMATTR Value 2N7002
SYMBOL pmos 7200 -96 M180
SYMATTR InstName M4
SYMATTR Value BSS84
SYMBOL res 7232 -80 R0
SYMATTR InstName R89
SYMATTR Value 50
SYMBOL res 7232 96 R0
SYMATTR InstName R90
SYMATTR Value 50
SYMBOL res 7600 272 R90
WINDOW 0 0 56 VBottom 2
WINDOW 3 32 56 VTop 2
SYMATTR InstName R91
SYMATTR Value 0.01
SYMBOL res 7600 -192 R90
WINDOW 0 0 56 VBottom 2
WINDOW 3 32 56 VTop 2
SYMATTR InstName R92
SYMATTR Value 0.01
SYMBOL res 7680 -320 R0
SYMATTR InstName R93
SYMATTR Value 1m
SYMBOL nmos 7648 208 R0
SYMATTR InstName M5
SYMATTR Value 2N7002
SYMBOL pmos 7648 -96 M180
SYMATTR InstName M6
SYMATTR Value BSS84
SYMBOL res 7680 -80 R0
SYMATTR InstName R94
SYMATTR Value 50
SYMBOL res 7680 96 R0
SYMATTR InstName R95
SYMATTR Value 50
SYMBOL res 8064 272 R90
WINDOW 0 0 56 VBottom 2
WINDOW 3 32 56 VTop 2
SYMATTR InstName R96
SYMATTR Value 0.01
SYMBOL res 8064 -192 R90
WINDOW 0 0 56 VBottom 2
WINDOW 3 32 56 VTop 2
SYMATTR InstName R97
SYMATTR Value 0.01
SYMBOL res 8144 -320 R0
SYMATTR InstName R98
SYMATTR Value 1m
SYMBOL nmos 8112 208 R0
SYMATTR InstName M7
SYMATTR Value 2N7002
SYMBOL pmos 8112 -96 M180
SYMATTR InstName M8
SYMATTR Value BSS84
SYMBOL res 8144 -80 R0
SYMATTR InstName R99
SYMATTR Value 50
SYMBOL res 8144 96 R0
SYMATTR InstName R100
SYMATTR Value 50
TEXT -560 320 Left 2 ;.tran 10u
TEXT -560 376 Left 2 ;.ac oct 100 1k 100mega
TEXT 2880 -736 Left 2 ;Circuits from https://ia802904.us.archive.org/32/items/bitsavers_tidataBookrdTTLSLSDataBook_39061488/1988_TTL_Logic_Standard_TTL_S_LS_Data_Book.pdf
TEXT 4376 -432 Left 2 ;74Sxx-series
TEXT 2352 -424 Left 2 ;74xx series (more or less)
TEXT -560 408 Left 2 !.dc V_IN 0 5 0.01
TEXT 720 768 Left 2 ;~4ns rise and fall, but enormous power consumption (mostly transient though)\nBase power is around 20mA per gate with an 80ns transient to ~70mA average.\nSeems to still beat 74Sxx in every metric possible.

The netlist it stands for:
* ttl_inverters.asc
R1 VCC OUT 50
V1 VCC 0 5
V_IN IN 0 PULSE(0.5 4.5 0 1n 1n 499n 1000n 10) AC 5
R2 N028 IN 100
Q1 OUT N028 0 0 2N3904
D1 N028 OUT BAT54
R4 N036 N017 100
Q2 OUT2 N036 0 0 2N3904
D2 N036 OUT2 BAT54
Q3 N026 N018 N001 0 2N3906
D3 N026 N018 BAT54
R5 N018 N017 100
R6 OUT2 0 100
R7 N001 OUT2 100
R9 N043 N042 0.01
Q4 OUT3 N043 0 0 2N3904
R10 N020 N019 0.01
R11 N041 0 1k
R12 N002 N041 1k
Q6 N019 N033 N042 0 2N3904
R13 N042 0 470
R14 N033 N032 0.01
D7 N026 OUT2 BAT54
R3 N002 N019 2.2k
R8 VCC N002 1m
R15 N002 N007 100
R16 N002 N030 100k
Q7 N032 N030 IN 0 2N3904
Q5 N007 N020 N027 0 2N3904
Q8 N050 N049 0 0 2N3904
D6 N049 N050 BAT54
D8 N005 N006 BAT54
R19 N051 0 1k
R20 NC_01 N051 1k
Q9 N005 N029 N044 0 2N3904
R21 N044 N049 500
R22 N029 N035 0.01
R23 N003 N005 100
R24 VCC N003 1m
R26 N003 N021 100
Q10 N035 N021 N034 0 2N3904
Q11 N006 N005 N031 0 2N3904
D9 N027 OUT3 1N914
Q12 OUT4 N044 0 0 2N3904
R27 N044 N050 250
D4 N044 OUT4 BAT54
Q13 N006 N031 OUT4 0 2N3904
R17 N003 N006 10
R25 N031 0 3.5k
D5 N029 N005 BAT54
D10 N021 N035 BAT54
R18 VCC N001 1m
R28 IN N017 1m
R29 N045 N012 0.01
R30 N013 N012 0.01
R36 VCC N004 1m
R37 N004 N008 1m
M1 N037 N045 0 0 2N7002
M2 N022 N013 N008 N008 BSS84
R33 N012 IN 50
R34 N092 N087 200
Q14 N088 N087 N100 0 2N3904
D11 N087 N088 BAT54
Q15 N079 N071 N059 0 2N3906
D12 N079 N071 BAT54
R35 N071 N063 200
R40 VCC N055 1m
R41 IN N070 1m
R42 N055 N063 1k
Q17 N075 N070 N092 0 2N3904
R43 N092 0 1k
Q16 N096 N070 N063 0 2N3906
R44 N055 N075 1m
R45 N055 N059 1m
R46 N096 0 1m
R47 N100 0 1m
R48 N079 OUT2a 1m
R49 OUT2a N088 1m
R38 N089 N081 200
Q18 N082 N081 N097 0 2N3904
D13 N081 N082 BAT54
Q19 N076 N065 N056 0 2N3906
D14 N076 N065 BAT54
R39 N065 N060 200
R50 VCC N052 1m
R51 N080 N064 1m
R52 N052 N060 1k
Q20 N072 N064 N089 0 2N3904
R53 N089 0 1k
Q21 N093 N064 N060 0 2N3906
R54 N052 N072 1m
R55 N052 N056 1m
R56 N093 0 1m
R57 N097 0 1m
R58 N076 OUT2b 1m
R59 OUT2b N082 1m
R60 N090 N083 200
Q22 N084 N083 N098 0 2N3904
D15 N083 N084 BAT54
Q23 N077 N067 N057 0 2N3906
D16 N077 N067 BAT54
R61 N067 N061 200
R62 VCC N053 1m
R63 OUT2b N066 1m
R64 N053 N061 1k
Q24 N073 N066 N090 0 2N3904
R65 N090 0 1k
Q25 N094 N066 N061 0 2N3906
R66 N053 N073 1m
R67 N053 N057 1m
R68 N094 0 1m
R69 N098 0 1m
R70 N077 OUT2c 1m
R71 OUT2c N084 1m
R72 N091 N085 200
Q26 N086 N085 N099 0 2N3904
D17 N085 N086 BAT54
Q27 N078 N069 N058 0 2N3906
D18 N078 N069 BAT54
R73 N069 N062 200
R74 VCC N054 1m
R75 OUT2c N068 1m
R76 N054 N062 1k
Q28 N074 N068 N091 0 2N3904
R77 N091 0 1k
Q29 N095 N068 N062 0 2N3906
R78 N054 N074 1m
R79 N054 N058 1m
R80 N095 0 1m
R81 N099 0 1m
R82 N078 OUT2d 1m
R83 OUT2d N086 1m
D19 OUT2a N080 BAT54
R84 N080 0 100
R85 IN N034 0.01
R31 N022 OUT_CMOS1 50
R32 OUT_CMOS1 N037 50
R86 N046 OUT_CMOS1 0.01
R87 N014 OUT_CMOS1 0.01
R88 N004 N009 1m
M3 N038 N046 0 0 2N7002
M4 N023 N014 N009 N009 BSS84
R89 N023 OUT_CMOS2 50
R90 OUT_CMOS2 N038 50
R91 N047 OUT_CMOS2 0.01
R92 N015 OUT_CMOS2 0.01
R93 N004 N010 1m
M5 N039 N047 0 0 2N7002
M6 N024 N015 N010 N010 BSS84
R94 N024 OUT_CMOS3 50
R95 OUT_CMOS3 N039 50
R96 N048 OUT_CMOS3 0.01
R97 N016 OUT_CMOS3 0.01
R98 N004 N011 1m
M7 N040 N048 0 0 2N7002
M8 N025 N016 N011 N011 BSS84
R99 N025 OUT_CMOS4 50
R100 OUT_CMOS4 N040 50
.model D D
.lib standard.dio
.model NPN NPN
.model PNP PNP
.lib standard.bjt
.model NMOS NMOS
.model PMOS PMOS
.lib standard.mos
* .tran 10u
* .ac oct 100 1k 100mega
* Circuits from https://ia802904.us.archive.org/32/items/bitsavers_tidataBookrdTTLSLSDataBook_39061488/1988_TTL_Logic_Standard_TTL_S_LS_Data_Book.pdf
* 74Sxx-series
* 74xx series (more or less)
.dc V_IN 0 5 0.01
* ~4ns rise and fall, but enormous power consumption (mostly transient though)
* Base power is around 20mA per gate with an 80ns transient to ~70mA average.
* Seems to still beat 74Sxx in every metric possible.
.backanno
.end